# EAGLE design 4_cpu_control (EAGLE 6.6.0)

## Sheet 1 of 2
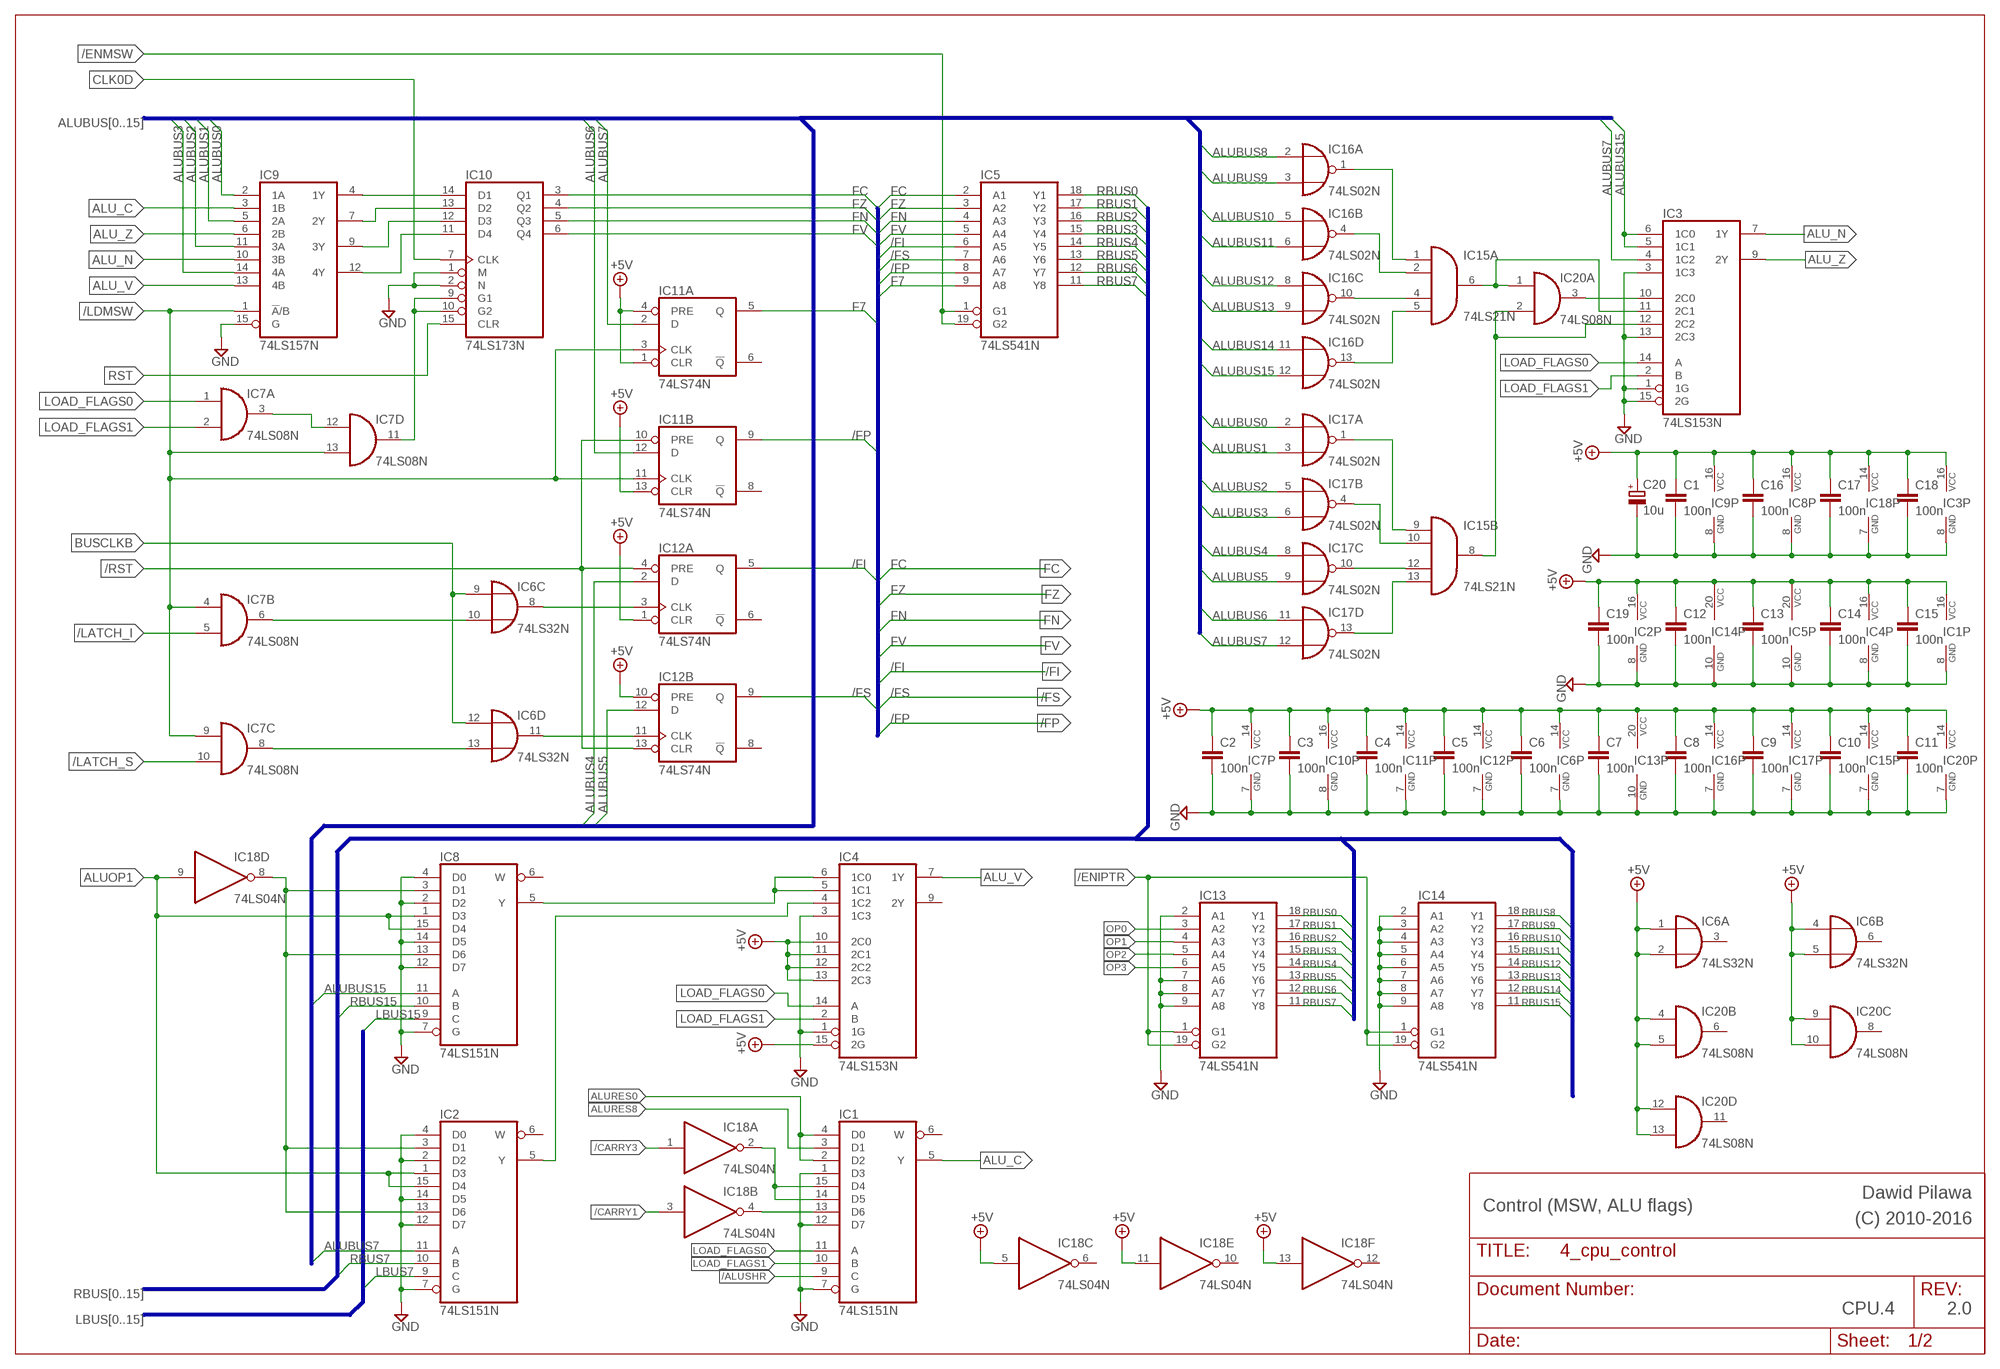
[diagram p0: schematic, sheet 1]

### Parts
C1  100n  C-EU050-024X044  [C050-024X044]
C2  100n  C-EU050-024X044  [C050-024X044]
C3  100n  C-EU050-024X044  [C050-024X044]
C4  100n  C-EU050-024X044  [C050-024X044]
C5  100n  C-EU050-024X044  [C050-024X044]
C6  100n  C-EU050-024X044  [C050-024X044]
C7  100n  C-EU050-024X044  [C050-024X044]
C8  100n  C-EU050-024X044  [C050-024X044]
C9  100n  C-EU050-024X044  [C050-024X044]
C10  100n  C-EU050-024X044  [C050-024X044]
C11  100n  C-EU050-024X044  [C050-024X044]
C12  100n  C-EU050-024X044  [C050-024X044]
C13  100n  C-EU050-024X044  [C050-024X044]
C14  100n  C-EU050-024X044  [C050-024X044]
C15  100n  C-EU050-024X044  [C050-024X044]
C16  100n  C-EU050-024X044  [C050-024X044]
C17  100n  C-EU050-024X044  [C050-024X044]
C18  100n  C-EU050-024X044  [C050-024X044]
C19  100n  C-EU050-024X044  [C050-024X044]
C20  10u  CPOL-EUE2.5-6  [E2,5-6]
IC1  74LS151N  [DIL16]
IC2  74LS151N  [DIL16]
IC3  74LS153N  [DIL16]
IC4  74LS153N  [DIL16]
IC5  74LS541N  [DIL20]
IC6  74LS32N  [DIL14]
IC7  74LS08N  [DIL14]
IC8  74LS151N  [DIL16]
IC9  74LS157N  [DIL16]
IC10  74LS173N  [DIL16]
IC11  74LS74N  [DIL14]
IC12  74LS74N  [DIL14]
IC13  74LS541N  [DIL20]
IC14  74LS541N  [DIL20]
IC15  74LS21N  [DIL14]
IC16  74LS02N  [DIL14]
IC17  74LS02N  [DIL14]
IC18  74LS04N  [DIL14]
IC20  74LS08N  [DIL14]

### Nets
+5V: C1.1 C2.1 C3.1 C4.1 C5.1 C6.1 C7.1 C8.1 C9.1 C10.1 C11.1 C12.1 C13.1 C14.1 C15.1 C16.1 C17.1 C18.1 C19.1 C20.+ IC1.16(VCC) IC2.16(VCC) IC3.16(VCC) IC4.10(2C0) IC4.11(2C1) IC4.12(2C2) IC4.13(2C3) IC4.15(2G) IC4.16(VCC) IC5.20(VCC) IC6.1(A:I0) IC6.2(A:I1) IC6.4(B:I0) IC6.5(B:I1) IC6.14(P:VCC) IC7.14(P:VCC) IC8.16(VCC) IC9.16(VCC) IC10.16(VCC) IC11.1(A:CLR) IC11.4(A:PRE) IC11.13(B:CLR) IC11.14(P:VCC) IC12.1(A:CLR) IC12.10(B:PRE) IC12.14(P:VCC) IC13.20(VCC) IC14.20(VCC) IC15.14(P:VCC) IC16.14(P:VCC) IC17.14(P:VCC) IC18.5(C:I) IC18.11(E:I) IC18.13(F:I) IC18.14(P:VCC) IC20.4(B:I0) IC20.5(B:I1) IC20.9(C:I0) IC20.10(C:I1) IC20.12(D:I0) IC20.13(D:I1) IC20.14(P:VCC) ; also sheet 2
/ALUSHR: IC1.9(C) ; also sheet 2
/CARRY1: IC18.3(B:I) ; also sheet 2
/CARRY3: IC18.1(A:I) ; also sheet 2
/ENIPTR: IC13.1(G1) IC13.19(G2) IC14.1(G1) IC14.19(G2) ; also sheet 2
/ENMSW: IC5.1(G1) IC5.19(G2) ; also sheet 2
/FI: IC5.6(A5) IC12.5(A:Q) ; also sheet 2
/FP: IC5.8(A7) IC11.9(B:Q) ; also sheet 2
/FS: IC5.7(A6) IC12.9(B:Q) ; also sheet 2
/LATCH_I: IC7.5(B:I1) ; also sheet 2
/LATCH_S: IC7.10(C:I1) ; also sheet 2
/LDMSW: IC7.4(B:I0) IC7.9(C:I0) IC7.13(D:I1) IC9.1(!A!/B) IC11.3(A:CLK) IC11.11(B:CLK) ; also sheet 2
/RST: IC11.10(B:PRE) IC12.4(A:PRE) IC12.13(B:CLR) ; also sheet 2
ALU_C: IC1.5(Y) IC9.3(1B)
ALU_N: IC3.7(1Y) IC9.10(3B)
ALU_V: IC4.7(1Y) IC9.13(4B)
ALU_Z: IC3.9(2Y) IC9.6(2B)
ALUBUS0: IC9.2(1A) IC17.2(A:I0) ; also sheet 2
ALUBUS1: IC9.5(2A) IC17.3(A:I1) ; also sheet 2
ALUBUS2: IC9.11(3A) IC17.5(B:I0) ; also sheet 2
ALUBUS3: IC9.14(4A) IC17.6(B:I1) ; also sheet 2
ALUBUS4: IC12.2(A:D) IC17.8(C:I0) ; also sheet 2
ALUBUS5: IC12.12(B:D) IC17.9(C:I1) ; also sheet 2
ALUBUS6: IC11.12(B:D) IC17.11(D:I0) ; also sheet 2
ALUBUS7: IC2.11(A) IC3.4(1C2) IC11.2(A:D) IC17.12(D:I1) ; also sheet 2
ALUBUS8: IC16.2(A:I0) ; also sheet 2
ALUBUS9: IC16.3(A:I1) ; also sheet 2
ALUBUS10: IC16.5(B:I0) ; also sheet 2
ALUBUS11: IC16.6(B:I1) ; also sheet 2
ALUBUS12: IC16.8(C:I0) ; also sheet 2
ALUBUS13: IC16.9(C:I1) ; also sheet 2
ALUBUS14: IC16.11(D:I0) ; also sheet 2
ALUBUS15: IC3.5(1C1) IC3.6(1C0) IC8.11(A) IC16.12(D:I1) ; also sheet 2
ALUOP1: IC2.1(D3) IC2.15(D4) IC8.1(D3) IC8.15(D4) IC18.9(D:I) ; also sheet 2
ALURES0: IC1.2(D2) IC1.4(D0) ; also sheet 2
ALURES8: IC1.3(D1) ; also sheet 2
BUSCLKB: IC6.9(C:I0) IC6.12(D:I0) ; also sheet 2
CLK0D: IC10.7(CLK) ; also sheet 2
F7: IC5.9(A8) IC11.5(A:Q)
FC: IC5.2(A1) IC10.3(Q1) ; also sheet 2
FN: IC5.4(A3) IC10.5(Q3) ; also sheet 2
FV: IC5.5(A4) IC10.6(Q4) ; also sheet 2
FZ: IC5.3(A2) IC10.4(Q2) ; also sheet 2
GND: C1.2 C2.2 C3.2 C4.2 C5.2 C6.2 C7.2 C8.2 C9.2 C10.2 C11.2 C12.2 C13.2 C14.2 C15.2 C16.2 C17.2 C18.2 C19.2 C20.- IC1.1(D3) IC1.7(G) IC1.8(GND) IC1.12(D7) IC2.2(D2) IC2.4(D0) IC2.7(G) IC2.8(GND) IC2.12(D7) IC2.14(D5) IC3.1(1G) IC3.3(1C3) IC3.8(GND) IC3.13(2C3) IC3.15(2G) IC4.1(1G) IC4.3(1C3) IC4.8(GND) IC5.10(GND) IC6.7(P:GND) IC7.7(P:GND) IC8.2(D2) IC8.4(D0) IC8.7(G) IC8.8(GND) IC8.12(D7) IC8.14(D5) IC9.8(GND) IC9.15(G) IC10.1(M) IC10.2(N) IC10.8(GND) IC11.7(P:GND) IC12.7(P:GND) IC13.2(A1) IC13.7(A6) IC13.8(A7) IC13.9(A8) IC13.10(GND) IC14.2(A1) IC14.3(A2) IC14.4(A3) IC14.5(A4) IC14.6(A5) IC14.7(A6) IC14.8(A7) IC14.9(A8) IC14.10(GND) IC15.7(P:GND) IC16.7(P:GND) IC17.7(P:GND) IC18.7(P:GND) IC20.7(P:GND) ; also sheet 2
LBUS7: IC2.9(C) ; also sheet 2
LBUS15: IC8.9(C) ; also sheet 2
LOAD_FLAGS0: IC1.11(A) IC3.14(A) IC4.14(A) IC7.1(A:I0) ; also sheet 2
LOAD_FLAGS1: IC1.10(B) IC3.2(B) IC4.2(B) IC7.2(A:I1) ; also sheet 2
N$1: IC4.5(1C1) IC4.6(1C0) IC8.5(Y)
N$2: IC1.13(D6) IC18.4(B:O)
N$3: IC1.14(D5) IC1.15(D4) IC18.2(A:O)
N$6: IC15.1(A:I0) IC16.1(A:O)
N$7: IC15.2(A:I1) IC16.4(B:O)
N$8: IC15.4(A:I2) IC16.10(C:O)
N$9: IC15.5(A:I3) IC16.13(D:O)
N$10: IC15.9(B:I0) IC17.1(A:O)
N$11: IC15.10(B:I1) IC17.4(B:O)
N$12: IC15.12(B:I2) IC17.10(C:O)
N$13: IC15.13(B:I3) IC17.13(D:O)
N$14: IC3.11(2C1) IC15.6(A:O) IC20.1(A:I0)
N$15: IC3.12(2C2) IC15.8(B:O) IC20.2(A:I1)
N$16: IC3.10(2C0) IC20.3(A:O)
N$17: IC7.11(D:O) IC10.9(G1) IC10.10(G2)
N$19: IC2.5(Y) IC4.4(1C2)
N$21: IC2.3(D1) IC2.13(D6) IC8.3(D1) IC8.13(D6) IC18.8(D:O)
N$32: IC9.4(1Y) IC10.14(D1)
N$48: IC9.7(2Y) IC10.13(D2)
N$49: IC9.9(3Y) IC10.12(D3)
N$50: IC9.12(4Y) IC10.11(D4)
N$51: IC7.3(A:O) IC7.12(D:I0)
N$52: IC6.8(C:O) IC12.3(A:CLK)
N$53: IC6.11(D:O) IC12.11(B:CLK)
N$54: IC6.10(C:I1) IC7.6(B:O)
N$55: IC6.13(D:I1) IC7.8(C:O)
OP0: IC13.3(A2) ; also sheet 2
OP1: IC13.4(A3) ; also sheet 2
OP2: IC13.5(A4) ; also sheet 2
OP3: IC13.6(A5) ; also sheet 2
RBUS0: IC5.18(Y1) IC13.18(Y1) ; also sheet 2
RBUS1: IC5.17(Y2) IC13.17(Y2) ; also sheet 2
RBUS2: IC5.16(Y3) IC13.16(Y3) ; also sheet 2
RBUS3: IC5.15(Y4) IC13.15(Y4) ; also sheet 2
RBUS4: IC5.14(Y5) IC13.14(Y5) ; also sheet 2
RBUS5: IC5.13(Y6) IC13.13(Y6) ; also sheet 2
RBUS6: IC5.12(Y7) IC13.12(Y7) ; also sheet 2
RBUS7: IC2.10(B) IC5.11(Y8) IC13.11(Y8) ; also sheet 2
RBUS8: IC14.18(Y1) ; also sheet 2
RBUS9: IC14.17(Y2) ; also sheet 2
RBUS10: IC14.16(Y3) ; also sheet 2
RBUS11: IC14.15(Y4) ; also sheet 2
RBUS12: IC14.14(Y5) ; also sheet 2
RBUS13: IC14.13(Y6) ; also sheet 2
RBUS14: IC14.12(Y7) ; also sheet 2
RBUS15: IC8.10(B) IC14.11(Y8) ; also sheet 2
RST: IC10.15(CLR) ; also sheet 2
Unconnected: IC1.6(W) IC2.6(W) IC4.9(2Y) IC6.3(A:O) IC6.6(B:O) IC8.6(W) IC11.6(A:!Q) IC11.8(B:!Q) IC12.6(A:!Q) IC12.8(B:!Q) IC18.6(C:O) IC18.10(E:O) IC18.12(F:O) IC20.6(B:O) IC20.8(C:O) IC20.11(D:O)

### Buses
ALUBUS[0..15]
FC,FZ,FN,FV,/FI,/FS,/FP,F7
RBUS[0..15]
LBUS[0..15]

### Notes on the sheet
- Dawid Pilawa
- Control (MSW, ALU flags) | (C) 2010-2016
- CPU.4 | 2.0

## Sheet 2 of 2
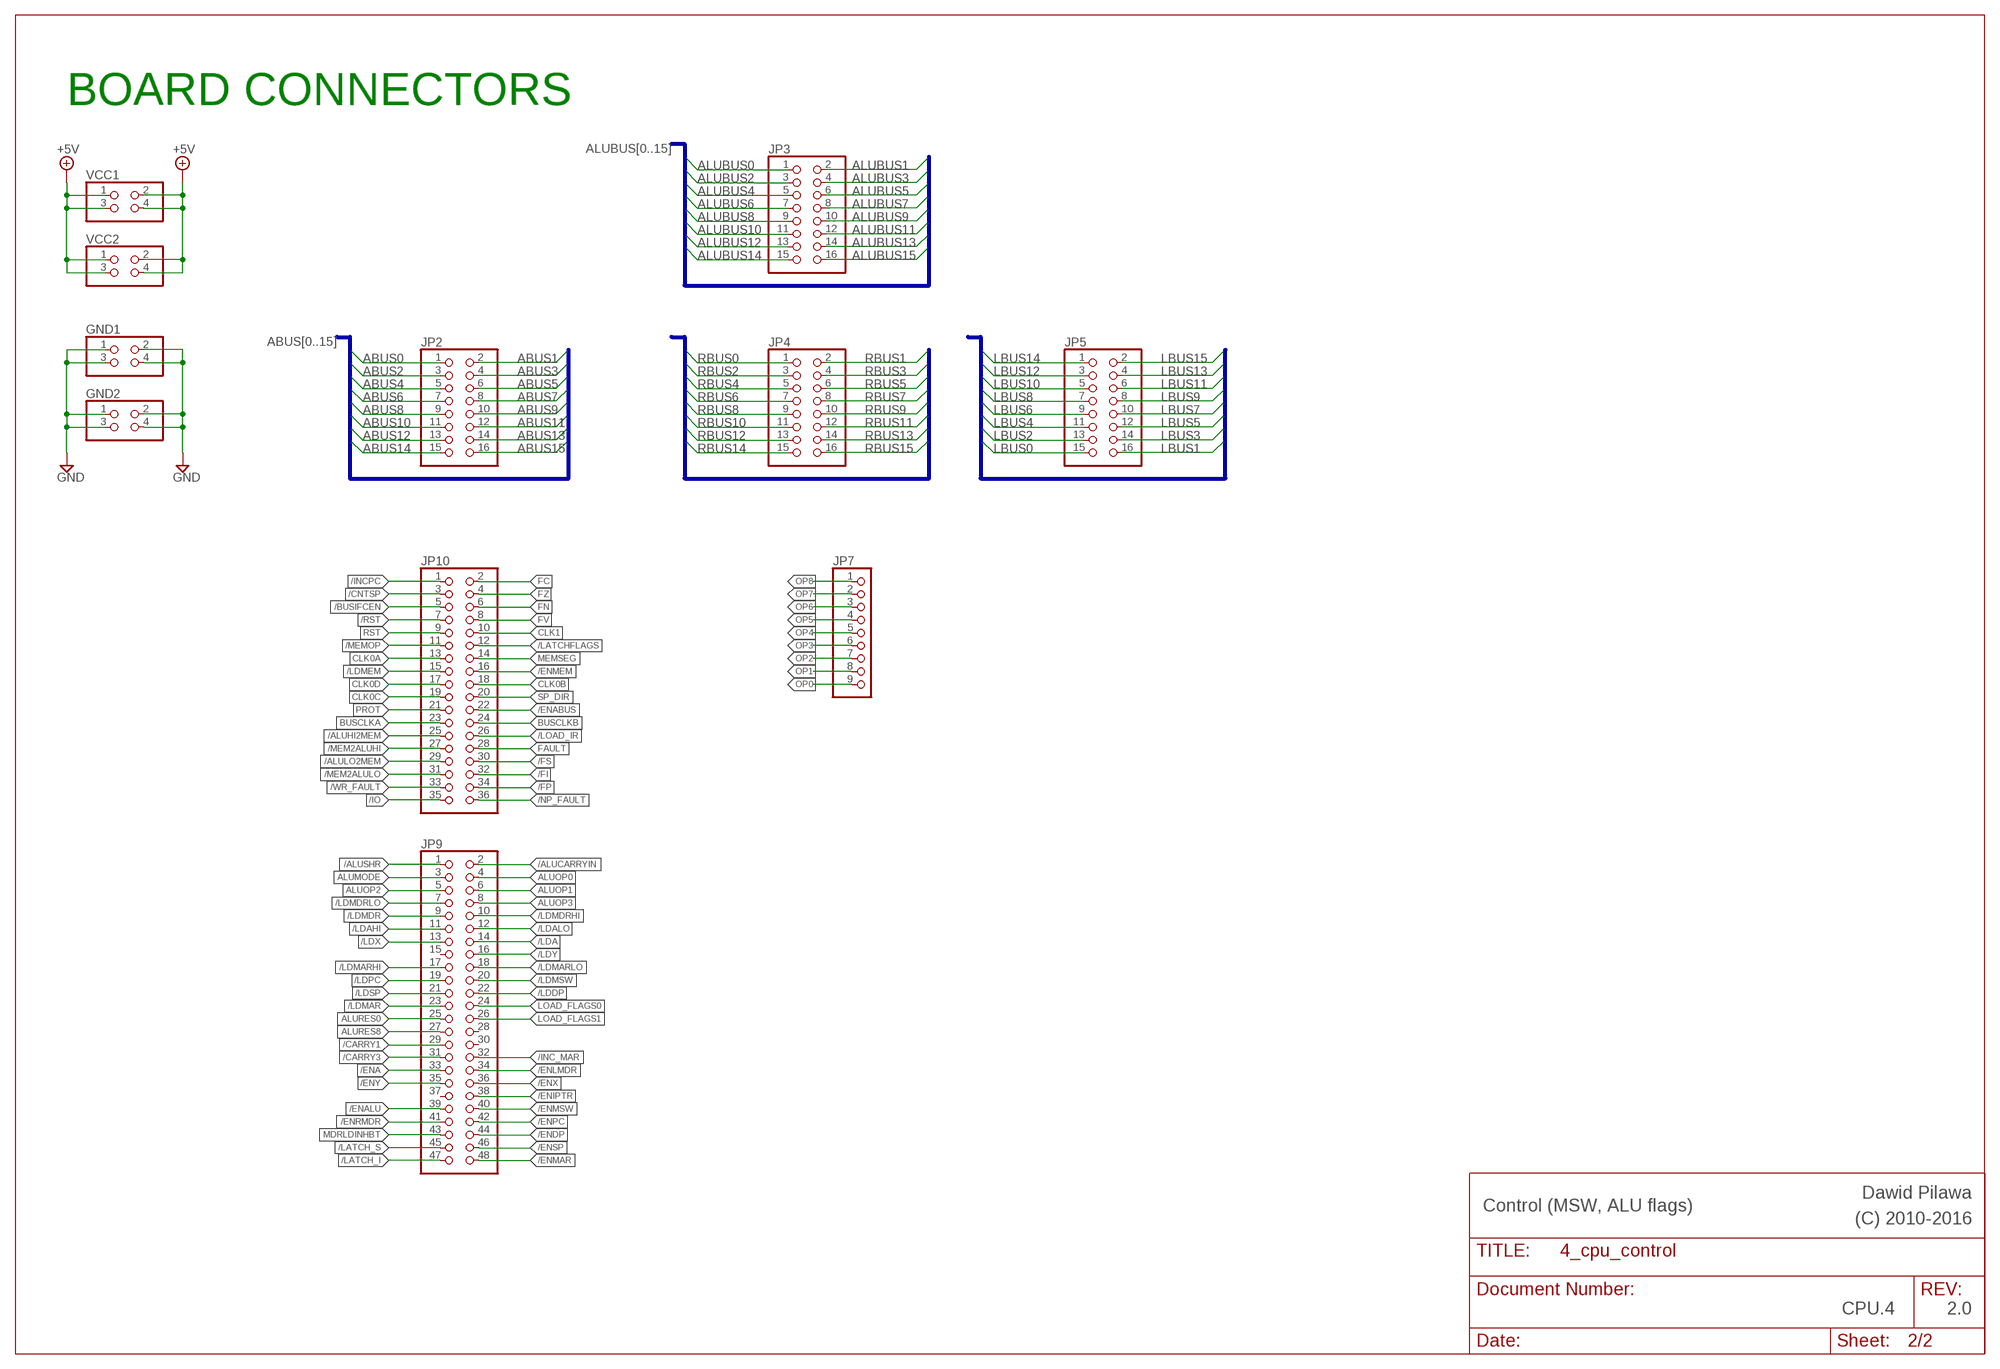
[diagram p1: schematic, sheet 2]

### Parts
GND1  PINHD-2X2  [2X02]
GND2  PINHD-2X2  [2X02]
JP2  PINHD-2X8  [2X08]
JP3  PINHD-2X8  [2X08]
JP4  PINHD-2X8  [2X08]
JP5  PINHD-2X8  [2X08]
JP7  PINHD-1X9  [1X09]
JP9  PINHD-2X24  [2X24]
JP10  PINHD-2X18  [2X18]
VCC1  PINHD-2X2  [2X02]
VCC2  PINHD-2X2  [2X02]

### Nets
+5V: VCC1.1 VCC1.2 VCC1.3 VCC1.4 VCC2.1 VCC2.2 VCC2.3 VCC2.4 ; also sheet 1
/ALUCARRYIN: JP9.2
/ALUHI2MEM: JP10.25
/ALULO2MEM: JP10.29
/ALUSHR: JP9.1 ; also sheet 1
/BUSIFCEN: JP10.5
/CARRY1: JP9.29 ; also sheet 1
/CARRY3: JP9.31 ; also sheet 1
/CNTSP: JP10.3
/ENA: JP9.33
/ENABUS: JP10.22
/ENALU: JP9.39
/ENDP: JP9.44
/ENIPTR: JP9.38 ; also sheet 1
/ENLMDR: JP9.34
/ENMAR: JP9.48
/ENMEM: JP10.16
/ENMSW: JP9.40 ; also sheet 1
/ENPC: JP9.42
/ENRMDR: JP9.41
/ENSP: JP9.46
/ENX: JP9.36
/ENY: JP9.35
/FI: JP10.32 ; also sheet 1
/FP: JP10.34 ; also sheet 1
/FS: JP10.30 ; also sheet 1
/INC_MAR: JP9.32
/INCPC: JP10.1
/IO: JP10.35
/LATCH_I: JP9.47 ; also sheet 1
/LATCH_S: JP9.45 ; also sheet 1
/LATCHFLAGS: JP10.12
/LDA: JP9.14
/LDAHI: JP9.11
/LDALO: JP9.12
/LDDP: JP9.22
/LDMAR: JP9.23
/LDMARHI: JP9.17
/LDMARLO: JP9.18
/LDMDR: JP9.9
/LDMDRHI: JP9.10
/LDMDRLO: JP9.7
/LDMEM: JP10.15
/LDMSW: JP9.20 ; also sheet 1
/LDPC: JP9.19
/LDSP: JP9.21
/LDX: JP9.13
/LDY: JP9.16
/LOAD_IR: JP10.26
/MEM2ALUHI: JP10.27
/MEM2ALULO: JP10.31
/MEMOP: JP10.11
/NP_FAULT: JP10.36
/RST: JP10.7 ; also sheet 1
/WR_FAULT: JP10.33
ABUS0: JP2.1
ABUS1: JP2.2
ABUS2: JP2.3
ABUS3: JP2.4
ABUS4: JP2.5
ABUS5: JP2.6
ABUS6: JP2.7
ABUS7: JP2.8
ABUS8: JP2.9
ABUS9: JP2.10
ABUS10: JP2.11
ABUS11: JP2.12
ABUS12: JP2.13
ABUS13: JP2.14
ABUS14: JP2.15
ABUS15: JP2.16
ALUBUS0: JP3.1 ; also sheet 1
ALUBUS1: JP3.2 ; also sheet 1
ALUBUS2: JP3.3 ; also sheet 1
ALUBUS3: JP3.4 ; also sheet 1
ALUBUS4: JP3.5 ; also sheet 1
ALUBUS5: JP3.6 ; also sheet 1
ALUBUS6: JP3.7 ; also sheet 1
ALUBUS7: JP3.8 ; also sheet 1
ALUBUS8: JP3.9 ; also sheet 1
ALUBUS9: JP3.10 ; also sheet 1
ALUBUS10: JP3.11 ; also sheet 1
ALUBUS11: JP3.12 ; also sheet 1
ALUBUS12: JP3.13 ; also sheet 1
ALUBUS13: JP3.14 ; also sheet 1
ALUBUS14: JP3.15 ; also sheet 1
ALUBUS15: JP3.16 ; also sheet 1
ALUMODE: JP9.3
ALUOP0: JP9.4
ALUOP1: JP9.6 ; also sheet 1
ALUOP2: JP9.5
ALUOP3: JP9.8
ALURES0: JP9.25 ; also sheet 1
ALURES8: JP9.27 ; also sheet 1
BUSCLKA: JP10.23
BUSCLKB: JP10.24 ; also sheet 1
CLK0A: JP10.13
CLK0B: JP10.18
CLK0C: JP10.19
CLK0D: JP10.17 ; also sheet 1
CLK1: JP10.10
FAULT: JP10.28
FC: JP10.2 ; also sheet 1
FN: JP10.6 ; also sheet 1
FV: JP10.8 ; also sheet 1
FZ: JP10.4 ; also sheet 1
GND: GND1.1 GND1.2 GND1.3 GND1.4 GND2.1 GND2.2 GND2.3 GND2.4 ; also sheet 1
LBUS0: JP5.15
LBUS1: JP5.16
LBUS2: JP5.13
LBUS3: JP5.14
LBUS4: JP5.11
LBUS5: JP5.12
LBUS6: JP5.9
LBUS7: JP5.10 ; also sheet 1
LBUS8: JP5.7
LBUS9: JP5.8
LBUS10: JP5.5
LBUS11: JP5.6
LBUS12: JP5.3
LBUS13: JP5.4
LBUS14: JP5.1
LBUS15: JP5.2 ; also sheet 1
LOAD_FLAGS0: JP9.24 ; also sheet 1
LOAD_FLAGS1: JP9.26 ; also sheet 1
MDRLDINHBT: JP9.43
MEMSEG: JP10.14
OP0: JP7.9 ; also sheet 1
OP1: JP7.8 ; also sheet 1
OP2: JP7.7 ; also sheet 1
OP3: JP7.6 ; also sheet 1
OP4: JP7.5
OP5: JP7.4
OP6: JP7.3
OP7: JP7.2
OP8: JP7.1
PROT: JP10.21
RBUS0: JP4.1 ; also sheet 1
RBUS1: JP4.2 ; also sheet 1
RBUS2: JP4.3 ; also sheet 1
RBUS3: JP4.4 ; also sheet 1
RBUS4: JP4.5 ; also sheet 1
RBUS5: JP4.6 ; also sheet 1
RBUS6: JP4.7 ; also sheet 1
RBUS7: JP4.8 ; also sheet 1
RBUS8: JP4.9 ; also sheet 1
RBUS9: JP4.10 ; also sheet 1
RBUS10: JP4.11 ; also sheet 1
RBUS11: JP4.12 ; also sheet 1
RBUS12: JP4.13 ; also sheet 1
RBUS13: JP4.14 ; also sheet 1
RBUS14: JP4.15 ; also sheet 1
RBUS15: JP4.16 ; also sheet 1
RST: JP10.9 ; also sheet 1
SP_DIR: JP10.20
Unconnected: JP9.15 JP9.28 JP9.30 JP9.37

### Buses
ALUBUS[0..15]
RBUS[0..15]
LBUS[0..15]
ABUS[0..15]

### Notes on the sheet
- BOARD CONNECTORS
- Dawid Pilawa
- Control (MSW, ALU flags) | (C) 2010-2016
- CPU.4 | 2.0

## Library data of the parts
C1-C19 = rcl:C-EU: CAPACITOR, European symbol
C20 = rcl:CPOL-EU: POLARIZED CAPACITOR, European symbol
GND1 GND2 VCC1 VCC2 = pinhead:PINHD-2X2: PIN HEADER
IC1 IC2 IC8 = 74xx-eu:74*151: Data SELECTOR/MULTIPLEXER
IC3 IC4 = 74xx-eu:74*153: Dual 4-line to 1-line data SELECTOR/MULTIPLEXER
IC5 IC13 IC14 = 74xx-us:74*541: Octal BUFFER and LINE DRIVER, 3-state
IC6 = 74xx-eu:74*32: Quad 2-input OR gate
IC7 IC20 = 74xx-eu:74*08: Quad 2-input AND gate
IC9 = 74xx-eu:74*157: Quadruple 2-line to 1-line data SELECTOR/MULTIPLEXER
IC10 = 74xx-eu:74*173: 4-bit D type REGISTER, 3-state
IC11 IC12 = 74xx-eu:74*74: Dual D type positive edge triggered FLIP FLOP, preset and clear
IC15 = 74xx-eu:74*21: Dual 4-input AND gate
IC16 IC17 = 74xx-eu:74*02: Quad 2-input NOR gate
IC18 = 74xx-eu:74*04: Hex INVERTER
JP2-JP5 = pinhead:PINHD-2X8: PIN HEADER
JP7 = pinhead:PINHD-1X9: PIN HEADER
JP9 = pinhead:PINHD-2X24: PIN HEADER
JP10 = pinhead:PINHD-2X18: PIN HEADER

## Board
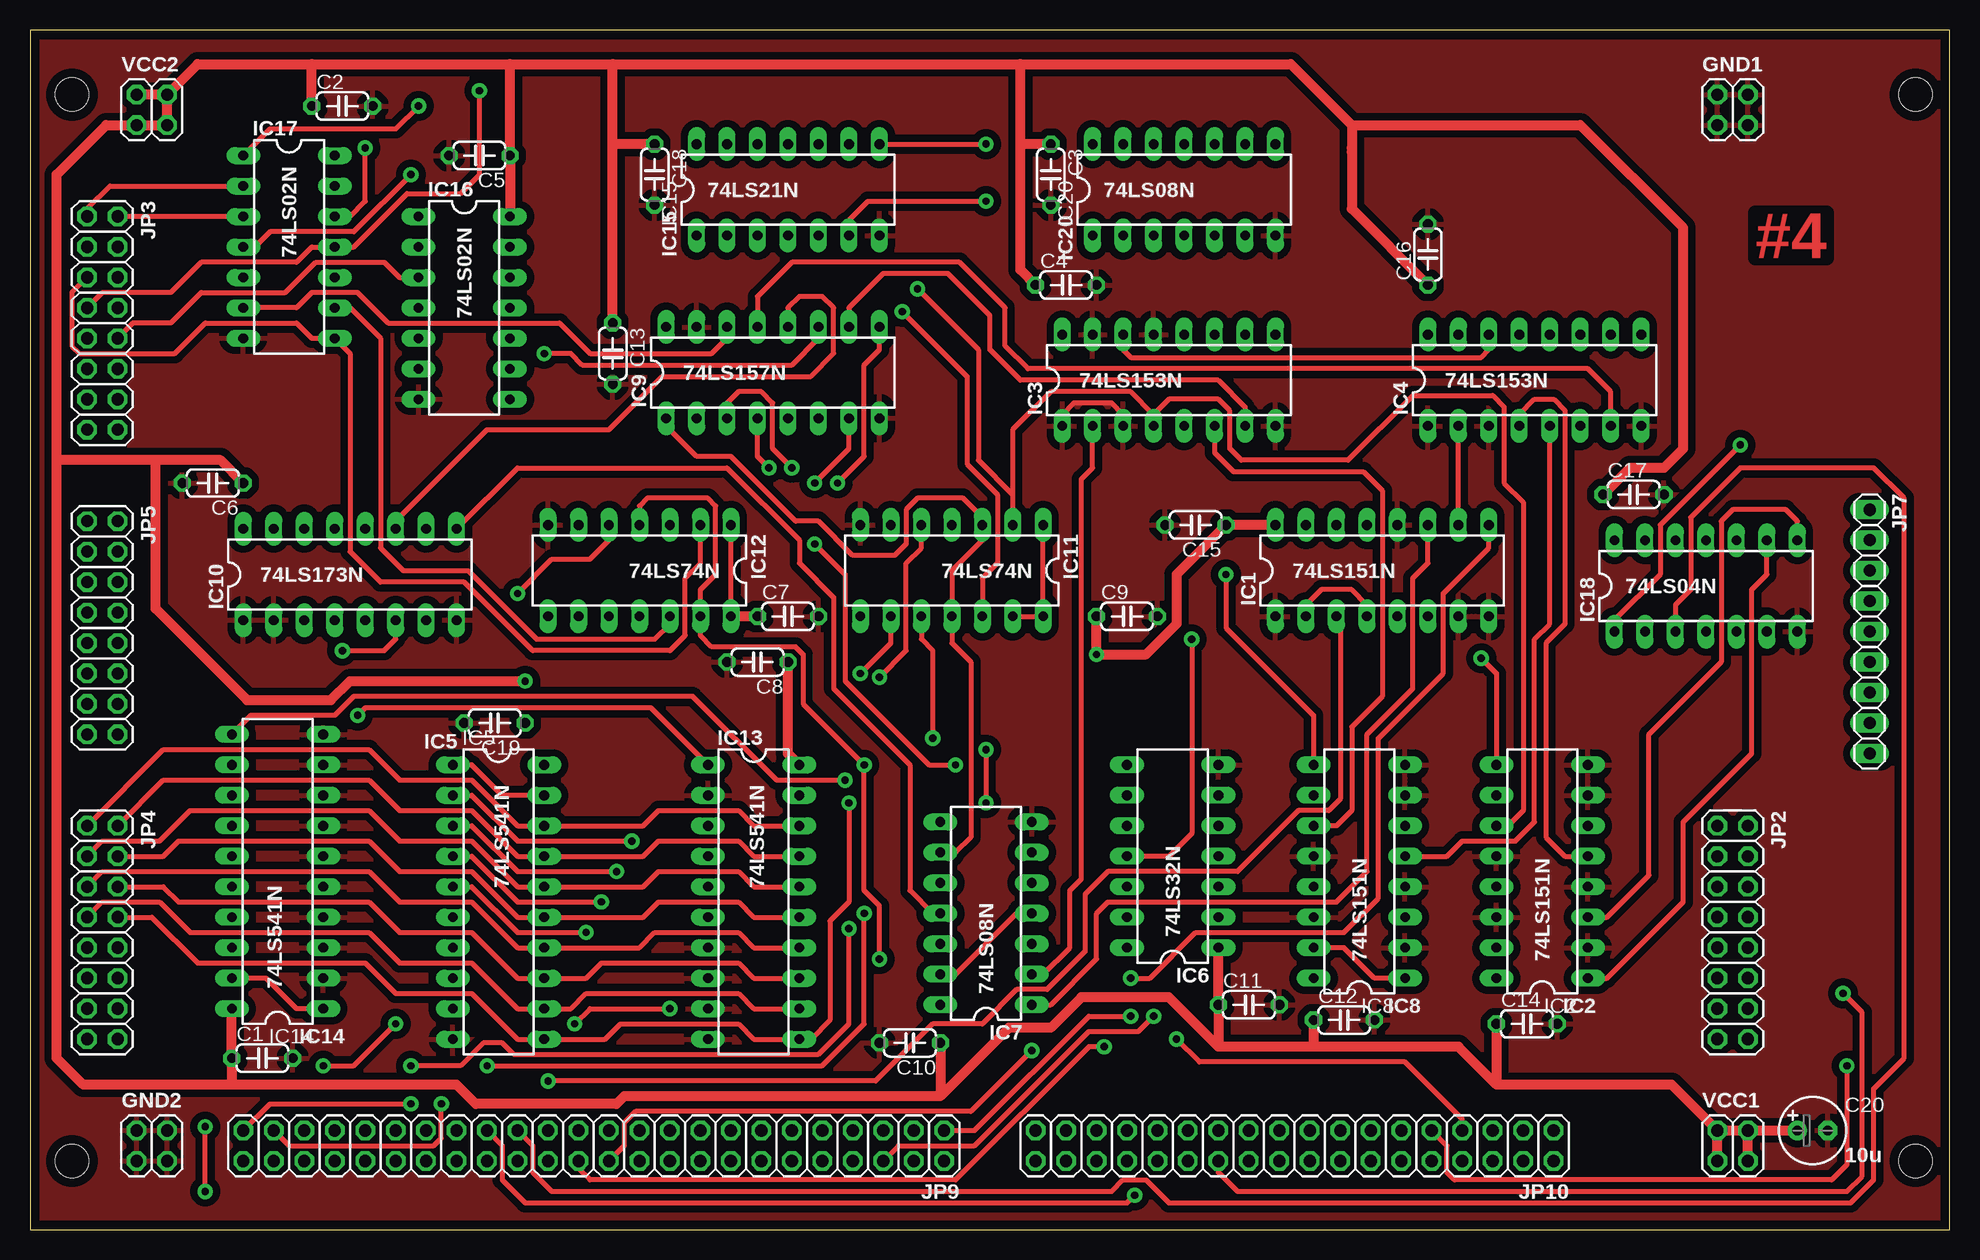
[diagram p2: board, top side]
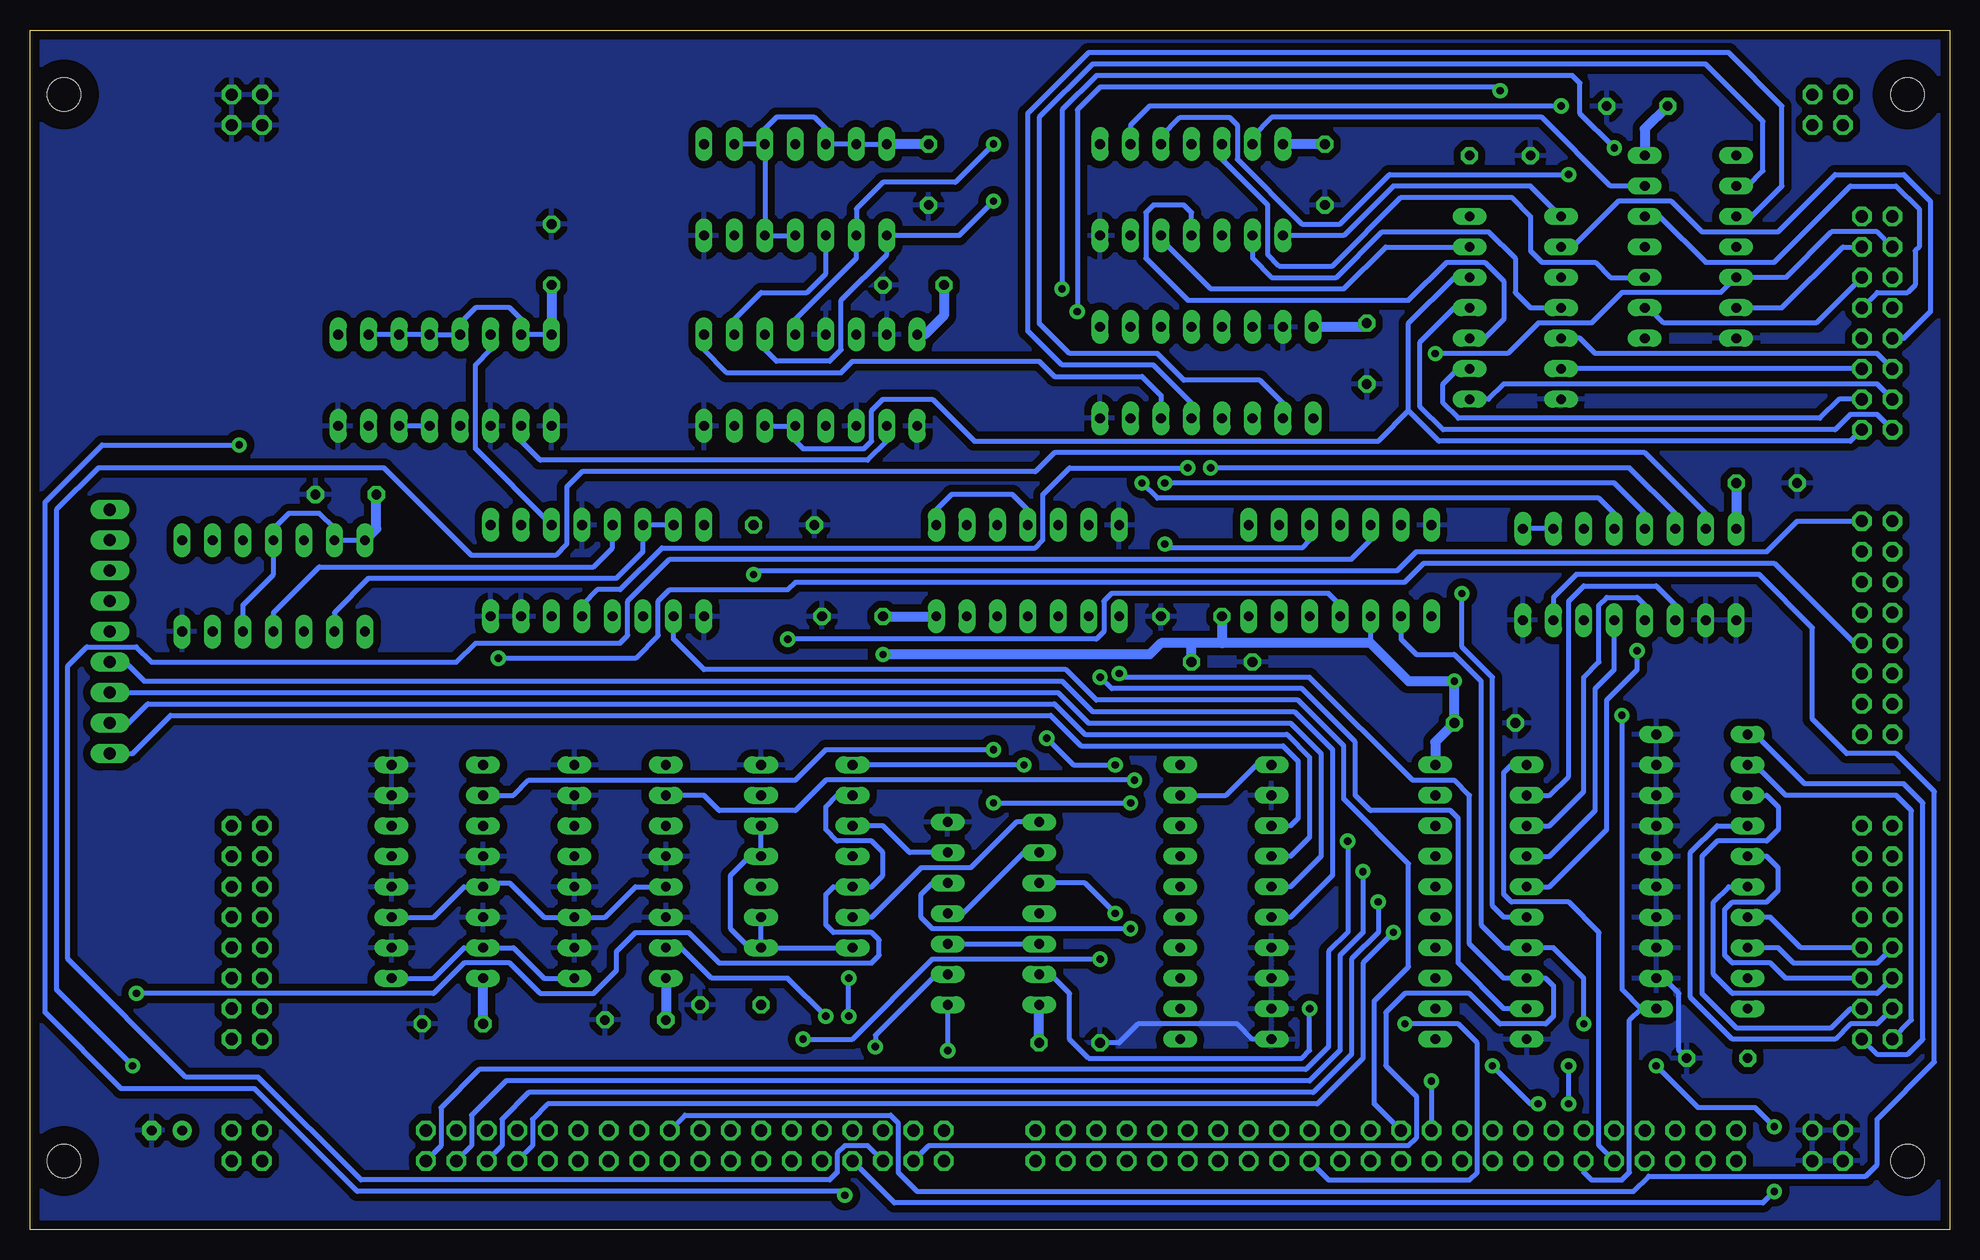
[diagram p3: board, bottom side, seen from below]

Size 160 x 100 mm. Coordinates in mm from the lower left corner, seen from the top.
Outline: 0,0 160,0 160,100 0,100 0,0
Copper layers (1*16): Top 0.035mm / dielectric 1.5mm / Bottom 0.035mm
Design rules "homebrew_pcb": minimum track width 16mil, minimum drill 24mil, track to track 16mil, track to pad 10mil, pad to pad 10mil, via to via 10mil, smd to smd 8mil, copper to edge 30mil, drill to drill 10mil, minimum pad ring 12mil, minimum via ring 12mil, stop-mask expansion 4mil, vias tented up to drill 0mil, thermal gap 24mil
Holes 2.79 mm at 3.49,94.61 3.49,5.71 157.16,5.71 157.16,94.61
bRestrict: area 1.2,92.3 to 5.8,96.9; area 1.2,3.4 to 5.8,8; area 154.9,3.4 to 159.4,8; area 154.9,92.3 to 159.4,96.9
vRestrict: area 1.2,92.3 to 5.8,96.9; area 154.9,3.4 to 159.4,8; area 154.9,92.3 to 159.4,96.9; area 1.2,3.4 to 5.8,8

### Footprints (pad centres in the part's own frame; a part is rotated, then mirrored left to right if it is on the bottom)
C050-024X044 = drill 0.813 octagon: 1 -2.54,0; 2 2.54,0
E2,5-6 = drill 0.813 pad 1.6: + -1.27,0 | drill 0.813 pad 1.6 octagon: - 1.27,0
2X02 = drill 1.016 octagon: 1 -1.27,-1.27; 2 -1.27,1.27; 3 1.27,-1.27; 4 1.27,1.27
DIL16 = drill 0.813 long: 1 -8.89,-3.81; 2 -6.35,-3.81; 3 -3.81,-3.81; 4 -1.27,-3.81; 5 1.27,-3.81; 6 3.81,-3.81; 7 6.35,-3.81; 8 8.89,-3.81; 9 8.89,3.81; 10 6.35,3.81; 11 3.81,3.81; 12 1.27,3.81; 13 -1.27,3.81; 14 -3.81,3.81; 15 -6.35,3.81; 16 -8.89,3.81
DIL20 = drill 0.813 long: 1 -11.43,-3.81; 2 -8.89,-3.81; 3 -6.35,-3.81; 4 -3.81,-3.81; 5 -1.27,-3.81; 6 1.27,-3.81; 7 3.81,-3.81; 8 6.35,-3.81; 9 8.89,-3.81; 10 11.43,-3.81; 11 11.43,3.81; 12 8.89,3.81; 13 6.35,3.81; 14 3.81,3.81; 15 1.27,3.81; 16 -1.27,3.81; 17 -3.81,3.81; 18 -6.35,3.81; 19 -8.89,3.81; 20 -11.43,3.81
DIL14 = drill 0.813 long: 1 -7.62,-3.81; 2 -5.08,-3.81; 3 -2.54,-3.81; 4 0,-3.81; 5 2.54,-3.81; 6 5.08,-3.81; 7 7.62,-3.81; 8 7.62,3.81; 9 5.08,3.81; 10 2.54,3.81; 11 0,3.81; 12 -2.54,3.81; 13 -5.08,3.81; 14 -7.62,3.81
2X08 = drill 1.016 octagon: 1 -8.89,-1.27; 2 -8.89,1.27; 3 -6.35,-1.27; 4 -6.35,1.27; 5 -3.81,-1.27; 6 -3.81,1.27; 7 -1.27,-1.27; 8 -1.27,1.27; 9 1.27,-1.27; 10 1.27,1.27; 11 3.81,-1.27; 12 3.81,1.27; 13 6.35,-1.27; 14 6.35,1.27; 15 8.89,-1.27; 16 8.89,1.27
1X09 = drill 1.016 long: 1 -10.16,0; 2 -7.62,0; 3 -5.08,0; 4 -2.54,0; 5 0,0; 6 2.54,0; 7 5.08,0; 8 7.62,0; 9 10.16,0
2X24 = drill 1.016 octagon: 1 -27.94,-1.27; 2 -27.94,1.27; 3 -25.4,-1.27; 4 -25.4,1.27; 5 -22.86,-1.27; 6 -22.86,1.27; 7 -20.32,-1.27; 8 -20.32,1.27; 9 -17.78,-1.27; 10 -17.78,1.27; 11 -15.24,-1.27; 12 -15.24,1.27; 13 -12.7,-1.27; 14 -12.7,1.27; 15 -10.16,-1.27; 16 -10.16,1.27; 17 -7.62,-1.27; 18 -7.62,1.27; 19 -5.08,-1.27; 20 -5.08,1.27; 21 -2.54,-1.27; 22 -2.54,1.27; 23 0,-1.27; 24 0,1.27; 25 2.54,-1.27; 26 2.54,1.27; 27 5.08,-1.27; 28 5.08,1.27; 29 7.62,-1.27; 30 7.62,1.27; 31 10.16,-1.27; 32 10.16,1.27; 33 12.7,-1.27; 34 12.7,1.27; 35 15.24,-1.27; 36 15.24,1.27; 37 17.78,-1.27; 38 17.78,1.27; 39 20.32,-1.27; 40 20.32,1.27; 41 22.86,-1.27; 42 22.86,1.27; 43 25.4,-1.27; 44 25.4,1.27; 45 27.94,-1.27; 46 27.94,1.27; 47 30.48,-1.27; 48 30.48,1.27
2X18 = drill 1.016 octagon: 1 -21.59,-1.27; 2 -21.59,1.27; 3 -19.05,-1.27; 4 -19.05,1.27; 5 -16.51,-1.27; 6 -16.51,1.27; 7 -13.97,-1.27; 8 -13.97,1.27; 9 -11.43,-1.27; 10 -11.43,1.27; 11 -8.89,-1.27; 12 -8.89,1.27; 13 -6.35,-1.27; 14 -6.35,1.27; 15 -3.81,-1.27; 16 -3.81,1.27; 17 -1.27,-1.27; 18 -1.27,1.27; 19 1.27,-1.27; 20 1.27,1.27; 21 3.81,-1.27; 22 3.81,1.27; 23 6.35,-1.27; 24 6.35,1.27; 25 8.89,-1.27; 26 8.89,1.27; 27 11.43,-1.27; 28 11.43,1.27; 29 13.97,-1.27; 30 13.97,1.27; 31 16.51,-1.27; 32 16.51,1.27; 33 19.05,-1.27; 34 19.05,1.27; 35 21.59,-1.27; 36 21.59,1.27

### Placement (x,y rotation side)
C1  19.37,14.29 0 top
C2  26.04,93.66 0 top
C3  85.09,87.95 270 top
C4  86.36,78.74 0 top
C5  37.47,89.53 180 top
C6  15.24,62.23 180 top
C7  63.18,51.12 0 top
C8  60.64,47.31 180 top
C9  91.44,51.12 0 top
C10  73.34,15.56 180 top
C11  101.6,18.73 0 top
C12  109.54,17.46 0 top
C13  48.58,73.03 270 top
C14  124.78,17.14 0 top
C15  97.16,58.74 180 top
C16  116.52,81.28 90 top
C17  133.67,61.28 0 top
C18  52.07,87.95 270 top
C19  38.73,42.23 180 top
C20  148.59,8.26 0 top
GND1  141.92,93.34 0 top
GND2  10.16,6.99 0 top
IC1  112.71,54.93 0 top
IC2  126.05,29.84 90 top
IC3  94.93,70.8 0 top
IC4  125.41,70.8 0 top
IC5  39.05,27.3 270 top
IC6  95.25,31.11 90 top
IC7  79.69,26.35 90 top
IC8  110.81,29.84 90 top
IC9  61.91,71.44 0 top
IC10  26.67,54.61 0 top
IC11  76.83,54.93 180 top
IC12  50.8,54.93 180 top
IC13  60.33,27.3 270 top
IC14  20.64,29.84 90 top
IC15  63.18,86.68 0 top
IC16  36.2,76.83 270 top
IC17  21.59,81.92 270 top
IC18  139.7,53.66 0 top
IC20  96.2,86.68 0 top
JP2  141.92,24.77 270 top
JP3  6.03,75.56 270 top
JP4  6.03,24.77 270 top
JP5  6.03,50.16 270 top
JP7  153.35,49.85 270 top
JP9  48.26,6.99 180 top
JP10  105.41,6.99 180 top
VCC1  141.92,6.99 0 top
VCC2  10.16,93.34 0 top

### Tracks (layer width: path | path; a pad name or v marks a point on that pad's centre or on a via)
+5V  (via drill 0.61 pad 1.27)
  Top 0.406: IC12.14 IC12.1 | IC11.1 IC11.14 IC11.13
  Top 0.813: VCC1.2 136.84,12.06 122.24,12.06 | 75.88,11.11 49.53,11.11 48.9,10.48 37.15,10.48 35.56,12.06 16.83,12.06 | 16.83,12.06 4.45,12.06 2.22,14.29 2.22,64.14 | 2.22,64.14 2.22,87.95 6.35,92.08 VCC2.1 VCC2.3 VCC2.4 | VCC2.4 13.97,97.16 23.5,97.16 | 23.5,97.16 40.01,97.16 | 40.01,97.16 48.58,97.16 | 48.58,97.16 82.55,97.16 | 82.55,97.16 105.09,97.16 110.17,92.08 | C13.1 48.58,90.49 | 48.58,90.49 48.58,97.16 | C18.1 48.58,90.49 | C2.1 23.5,97.16 | 40.01,97.16 C5.1 IC16.14 | 82.55,90.49 82.55,97.16 | C3.1 82.55,90.49 | C7.1 IC12.14 | IC1.16 C15.1 95.57,54.61 95.57,50.48 93.03,47.94 v88.9,47.94 C9.1 | VCC2.4 VCC2.2 | VCC1.1 VCC1.2 | VCC1.3 VCC1.4 | VCC1.2 VCC1.4 | VCC1.4 C20.+ | C10.1 75.88,11.11 | IC6.1 C11.1 99.06,15.24 | C14.1 122.24,12.06 | 82.55,90.49 82.55,80.01 C4.1 | C6.1 15.88,64.14 10.48,64.14 | 10.48,64.14 2.22,64.14 | 10.48,64.14 10.48,51.75 18.1,44.13 25.08,44.13 26.67,45.72 v41.27,45.72 | IC13.20 63.18,39.69 C8.1 | 122.24,12.06 119.06,15.24 107,15.24 | 107,15.24 99.06,15.24 | 99.06,15.24 94.93,19.37 87.63,19.37 85.09,16.83 81.6,16.83 75.88,11.11 | C12.1 107,15.24 | IC14.20 C1.1 16.83,12.06 | C17.1 133.35,63.5 136.21,63.5 137.79,65.09 137.79,83.5 129.22,92.08 110.17,92.08 | C16.1 110.17,85.09 110.17,89.85 110.17,90.17 110.17,92.08
  Bottom 0.406: IC18.14 IC18.13 134.62,58.42 135.89,59.69 138.43,59.69 139.7,58.42 IC18.11 139.7,54.61 142.24,52.07 IC18.5 | IC20.14 IC20.13 IC20.12 93.66,91.76 94.61,92.71 97.79,92.71 98.74,91.76 IC20.10 | IC20.10 IC20.9 | IC20.10 IC20.5 IC20.4 | IC4.16 IC4.15 119.06,75.88 120.02,76.83 122.87,76.83 124.14,75.56 IC4.13 IC4.12 IC4.11 IC4.10 | IC11.4 76.83,60.01 78.11,61.28 83.19,61.28 84.45,60.01 IC11.1 | IC12.10 48.26,48.9 | IC6.1 IC6.14 | IC6.5 IC6.4 100.01,31.11 101.6,29.53 101.6,25.08 100.01,23.5 IC6.1 | IC6.1 IC6.2
  Bottom 0.813: C13.1 48.9,75.25 IC9.16 | C18.1 IC15.14 | C2.1 25.4,91.76 IC17.14 | C16.1 IC4.16 | C3.1 IC20.14 | C9.1 IC11.14 | C10.1 IC7.14 | C14.1 IC2.16 | IC18.14 131.13,58.42 C17.1 | C4.1 83.82,76.2 85.41,74.61 IC3.16 | C6.1 IC10.16 | IC5.20 42.86,40.64 C19.1 v41.27,45.72 45.09,45.72 48.26,48.9 60.64,48.9 | 60.64,48.9 63.18,48.9 | 63.18,48.9 65.72,48.9 66.67,47.94 v88.9,47.94 | C7.1 60.64,48.9 | C8.1 63.18,48.9 | IC8.16 C12.1
/ALUSHR  (via drill 0.61 pad 1.27)
  Top 0.406: v91.76,20.95 93.34,20.95 97.16,24.77 109.54,24.77 112.39,27.62 112.39,40.96 117.79,46.35 117.79,53.02 121.6,56.83 IC1.9 | JP9.1 78.74,8.26 88.27,17.78 v91.76,17.78
  Bottom 0.406: v91.76,17.78 v91.76,20.95
/CARRY1
  Top 0.406: JP9.29 41.91,6.99 41.91,4.76 43.5,3.17 90.17,3.17 91.12,4.13 93.03,4.13 94.93,2.22 151.76,2.22 153.67,4.13 153.67,11.75 156.21,14.29 156.21,60.96 153.67,63.5 142.56,63.5 138.43,59.37 138.43,53.34 137.16,52.07 IC18.3
/CARRY3  (via drill 0.61 pad 1.27)
  Top 0.406: JP9.31 39.37,6.99 39.37,4.13 41.27,2.22 91.44,2.22 v92.08,2.86 | v142.56,65.41 135.89,58.74 135.89,54.61 132.08,50.8 IC18.1
  Bottom 0.406: v92.08,2.86 92.39,3.17 132.72,3.17 141.29,11.75 152.4,11.75 158.75,18.1 158.75,60.64 153.99,65.41 v142.56,65.41
/ENIPTR  (via drill 0.61 pad 1.27)
  Top 0.406: IC13.1 51.75,43.5 27.94,43.5 v27.3,42.86 | IC14.1 22.23,18.41 19.68,20.95 IC14.19
  Bottom 0.406: 30.48,6.35 JP9.38 30.48,4.76 29.84,4.13 27.3,4.13 26.67,4.76 26.67,17.46 25.72,18.41 | IC13.19 60.33,36.2 57.78,38.73 IC13.1 | v27.3,42.86 27.3,20 25.72,18.41 | 25.72,18.41 IC14.1
/ENMSW
  Top 0.406: IC5.19 39.37,36.2 36.83,38.73 IC5.1
  Bottom 0.406: JP9.40 29.21,6.99 29.21,24.77 31.75,27.3 36.51,27.3 37.15,27.94 37.15,38.1 36.51,38.73 IC5.1
/FI  (via drill 0.61 pad 1.27)
  Top 0.406: v40.64,53.02 43.5,55.88 46.67,55.88 48.26,57.47 IC12.5
  Bottom 0.406: IC5.6 37.15,26.04 38.1,26.99 38.1,46.04 40.64,48.58 v40.64,53.02 | IC12.5 48.26,57.47 49.85,55.88 106.68,55.88 110.17,52.39 110.17,49.53 110.81,48.9 122.87,48.9 124.46,47.31 149.86,47.31 151.13,48.58 155.26,48.58 156.84,46.99 156.84,22.54 147,12.7 140.97,12.7 132.4,4.13 93.34,4.13 92.71,4.76 92.71,6.35 92.08,6.99 90.17,6.99 JP10.32
/FP  (via drill 0.61 pad 1.27)
  Top 0.406: v69.22,46.35 71.75,48.9 IC11.9
  Bottom 0.406: v69.22,46.35 68.9,46.04 53.34,46.04 44.77,37.47 41.27,37.47 40.01,36.2 40.01,23.81 37.15,20.95 IC5.8 33.66,20.95 33.02,20.32 33.02,17.78 33.66,17.14 37.47,17.14 40.01,19.68 45.4,19.68 46.99,18.1 46.99,13.65 44.45,11.11 44.45,7.62 45.09,6.99 85.09,6.99 JP10.34
/FS  (via drill 0.61 pad 1.27)
  Top 0.406: v14.61,3.17 v14.61,8.57 | v24.45,13.65 26.99,13.65 v30.48,17.14
  Bottom 0.406: IC12.9 45.72,49.21 44.45,47.94 41.27,47.94 39.05,45.72 39.05,25.4 37.15,23.5 IC5.7 33.02,23.5 30.48,20.95 v30.48,17.14 | v14.61,8.57 16.19,10.16 20.95,10.16 v24.45,13.65 | v14.61,3.17 15.56,2.22 87.95,2.22 JP10.30
/LATCH_I  (via drill 0.61 pad 1.27)
  Top 0.406: JP9.47 20,10.48 v31.75,10.48 | v68.26,25.08 68.26,17.14 65.72,14.61 40.32,14.61 39.37,15.56 37.78,15.56 35.88,13.65 v31.75,13.65
  Bottom 0.406: v31.75,10.48 v31.75,13.65 | v68.26,25.08 84.77,25.08 85.72,26.04 85.72,27.94 84.77,28.89 IC7.5
/LATCH_S  (via drill 0.61 pad 1.27)
  Top 0.406: JP9.45 21.59,6.99 33.66,6.99 34.29,7.62 v34.29,10.48 | v38.1,13.65 66.04,13.65 69.53,17.14 v69.53,26.35
  Bottom 0.406: v34.29,10.48 34.92,10.48 v38.1,13.65 | v69.53,26.35 72.07,28.89 IC7.10
/LDMSW  (via drill 0.61 pad 1.27)
  Top 0.406: IC9.1 53.02,66.99 55.56,64.45 58.42,64.45 63.82,59.05 65.72,59.05 68.58,56.2 72.07,56.2 73.03,57.15 73.03,60.01 73.98,60.96 77.79,60.96 79.38,59.37 IC11.3 79.38,57.47 76.83,54.93 IC11.11 76.83,48.9 78.42,47.31 78.42,32.7 77.15,31.43 IC7.9 | IC7.13 77.15,21.27 82.23,26.35 IC7.4 | v45.4,17.14 46.67,18.41 v53.34,18.41
  Bottom 0.406: IC7.4 82.23,26.35 77.15,31.43 IC7.9 | JP9.20 51.75,4.13 40.01,4.13 39.37,4.76 39.37,15.56 40.96,17.14 v45.4,17.14 | v53.34,18.41 53.34,14.92 53.98,14.29 71.75,14.29 73.34,15.88 73.34,19.68 74.93,21.27 IC7.13
/RST  (via drill 0.61 pad 1.27)
  Top 0.406: IC12.4 50.8,60.33 51.44,60.96 56.52,60.96 57.15,60.33 57.15,54.61 55.88,53.34 IC12.13 55.88,49.53 56.83,48.58 63.82,48.58 64.45,47.94 64.45,43.81 v69.53,38.73 69.53,28.26 70.8,26.99 v70.8,22.54 | JP10.7 119.38,9.21 114.62,13.97 97.47,13.97 v95.57,15.88 | IC11.10 74.3,49.21 75.25,48.26 v75.25,40.96
  Bottom 0.406: v70.8,22.54 84.77,22.54 91.44,15.88 v95.57,15.88 | v75.25,40.96 73.03,38.73 v69.53,38.73
ALU_C  (via drill 0.61 pad 1.27)
  Top 0.406: v63.5,63.5 61.91,65.09 61.91,68.9 60.96,69.85 59.05,69.85 58.1,68.9 IC9.3
  Bottom 0.406: v63.5,63.5 73.34,63.5 75.56,61.28 75.56,57.47 76.2,56.83 107.31,56.83 110.81,53.34 112.71,53.34 113.98,52.07 IC1.5
ALU_N
  Top 0.406: IC9.10 68.26,76.83 71.12,79.69 76.52,79.69 80.01,76.2 80.01,73.34 82.55,70.8 99.06,70.8 101.28,68.58 IC3.7
ALU_V
  Top 0.406: IC4.7 131.76,69.85 129.86,71.75 83.19,71.75 81.28,73.66 81.28,76.83 77.47,80.64 63.5,80.64 60.64,77.79 IC9.13
ALU_Z
  Bottom 0.406: IC9.6 65.72,69.53 67.31,71.12 74.61,71.12 75.88,72.39 91.44,72.39 92.39,71.44 101.92,71.44 103.82,73.34 IC3.9
ALUBUS0
  Top 0.406: JP3.1 4.76,85.09 6.67,87 IC17.2
  Bottom 0.406: IC9.2 55.56,68.9 57.47,70.8 63.82,70.8 66.04,73.03 73.34,73.03 75.88,75.56 75.88,92.71 71.44,97.16 20.32,97.16 15.56,92.39 15.56,88.27 16.83,87 IC17.2
ALUBUS1
  Top 0.406: IC17.3 JP3.2
  Bottom 0.406: IC9.5 63.18,68.9 66.36,72.07 73.98,72.07 76.83,74.93 76.83,93.03 71.75,98.11 18.41,98.11 13.97,93.66 13.97,87 16.51,84.45 IC17.3
ALUBUS2  (via drill 0.61 pad 1.27)
  Top 0.406: IC9.11 65.72,74.3 63.5,72.07 46.04,72.07 45.09,73.03 v42.86,73.03
  Bottom 0.406: JP3.3 6.03,83.19 9.84,83.19 13.65,79.38 IC17.5 19.05,78.11 27.3,78.11 29.84,75.56 34.29,75.56 36.83,73.03 v42.86,73.03
ALUBUS3
  Top 0.406: IC9.14 58.1,74.3 56.83,73.03 46.67,73.03 44.13,75.56 29.84,75.56 27.3,78.11 23.5,78.11 22.23,76.83 IC17.6
  Bottom 0.406: IC17.6 13.97,76.83 8.89,81.92 JP3.4
ALUBUS4
  Top 0.406: JP3.5 3.49,78.11 3.49,73.66 4.13,73.03 12.06,73.03 14.61,75.56 22.23,75.56 23.5,74.3 IC17.8 26.67,73.03 26.67,56.52 29.21,53.98 36.2,53.98 41.91,48.26 53.34,48.26 54.61,49.53 54.61,54.29 55.88,55.56 IC12.2
ALUBUS5
  Top 0.406: IC17.9 26.67,76.83 29.21,74.3 29.21,56.83 31.11,54.93 36.51,54.93 42.23,49.21 52.07,49.21 53.34,50.48 IC12.12
  Bottom 0.406: JP3.6 11.11,75.56 23.81,75.56 25.08,76.83 IC17.9
ALUBUS6  (via drill 0.61 pad 1.27)
  Top 0.406: JP3.7 6.03,78.11 11.75,78.11 14.29,80.64 22.23,80.64 23.5,81.92 IC17.11 26.99,81.92 31.43,86.36 35.88,86.36 37.47,87.95 v37.47,94.93 | v72.71,76.52 78.11,71.12 78.11,63.82 80.64,61.28 80.64,55.56 79.38,54.29 IC11.12
  Bottom 0.406: v37.47,94.93 37.78,95.25 70.8,95.25 72.71,93.34 v72.71,76.52
ALUBUS7  (via drill 0.61 pad 1.27)
  Top 0.406: IC17.12 26.67,84.45 27.94,85.72 v27.94,90.17 | v73.98,78.42 79.06,73.34 79.06,64.14 81.92,61.28 IC11.2 81.92,66.67 85.09,69.85 91.76,69.85 93.66,67.94 | 93.66,67.94 94.93,69.22 99.06,69.22 100.01,68.26 100.01,65.09 100.97,64.14 109.86,64.14 115.25,69.53 121.92,69.53 122.87,68.58 122.87,62.23 124.46,60.64 124.46,34.92 123.19,33.66 IC2.11 | IC3.4 93.66,67.94
  Bottom 0.406: v27.94,90.17 30.8,93.03 30.8,95.57 31.43,96.2 71.12,96.2 73.98,93.34 v73.98,78.42 | JP3.8 6.03,78.11 3.49,78.11 2.86,78.74 2.86,81.6 2.54,81.92 2.54,85.09 4.45,87 8.26,87 14.61,80.64 20.32,80.64 24.13,84.45 IC17.12
ALUBUS8
  Bottom 0.406: JP3.9 3.81,74.3 1.59,76.52 1.59,85.72 3.81,87.95 9.53,87.95 14.29,83.19 20.64,83.19 23.18,85.72 27.62,85.72 31.43,81.92 IC16.2
ALUBUS9
  Top 0.406: JP3.10 8.57,75.56 11.75,75.56 14.29,78.11 21.27,78.11 23.81,80.64 29.53,80.64 30.8,79.38 IC16.3
ALUBUS10
  Bottom 0.406: JP3.11 6.03,73.03 29.53,73.03 30.8,74.3 IC16.5
ALUBUS11
  Bottom 0.406: JP3.12 IC16.6
ALUBUS12
  Bottom 0.406: JP3.13 6.03,70.48 37.15,70.48 38.42,69.22 IC16.8
ALUBUS13
  Bottom 0.406: JP3.14 9.21,69.22 10.79,67.63 40.96,67.63 42.23,68.9 42.23,70.48 40.96,71.75 IC16.9
ALUBUS14
  Bottom 0.406: JP3.15 6.03,67.94 8.26,67.94 9.53,66.67 42.23,66.67 44.13,68.58 44.13,73.98 41.27,76.83 IC16.11
ALUBUS15
  Top 0.406: IC3.6 98.74,64.77 100.33,63.18 111.12,63.18 112.71,61.59 112.71,44.45 110.17,41.91 110.17,34.92 108.9,33.66 IC8.11
  Bottom 0.406: JP3.16 8.26,65.72 42.55,65.72 45.09,68.26 | IC16.12 41.27,79.38 45.09,75.56 45.09,68.26 | IC3.6 IC3.5 96.2,65.72 95.57,65.09 90.49,65.09 89.85,65.72 89.85,68.26 88.9,69.22 84.77,69.22 81.28,65.72 47.62,65.72 45.09,68.26
ALUOP1  (via drill 0.61 pad 1.27)
  Top 0.406: IC2.1 131.44,20.95 137.79,27.3 137.79,33.97 143.51,39.69 143.51,53.34 144.78,54.61 IC18.9 | IC8.1 112.08,20.95 109.54,23.5 IC8.15 | JP9.6 72.39,6.99 78.74,6.99 88.27,16.51 92.39,16.51 v93.66,17.78
  Bottom 0.406: IC2.1 126.36,20.95 123.83,23.5 IC2.15 119.7,23.5 117.16,20.95 IC8.1 | v93.66,17.78 96.84,20.95 103.19,20.95 105.73,23.5 IC8.15
ALURES0
  Top 0.406: IC1.4 111.44,52.07 110.17,53.34 107.63,53.34 106.36,52.07 IC1.2
  Bottom 0.406: JP9.25 47.94,10.48 47.94,19.05 45.09,21.91 45.09,30.48 50.48,35.88 50.48,40.32 54.29,44.13 71.12,44.13 73.66,46.67 103.82,46.67 106.36,49.21 IC1.2
ALURES8  (via drill 0.61 pad 1.27)
  Top 0.406: IC1.3 109.22,50.8 109.22,35.88 108.27,34.92 105.73,34.92 100.65,29.84 89.85,29.84 87.95,27.94 87.95,23.18 84.77,20 82.23,20 79.38,17.14 75.25,17.14 70.48,12.38 v43.18,12.38
  Bottom 0.406: v43.18,12.38 JP9.27
BUSCLKB  (via drill 0.61 pad 1.27)
  Top 0.406: JP10.24 99.06,4.76 100.65,3.17 151.45,3.17 152.72,4.45 152.72,18.1 v151.13,19.68
  Bottom 0.406: v151.13,19.68 126.36,19.68 123.83,22.23 120.02,22.23 117.47,19.68 113.03,19.68 111.12,21.59 111.12,23.18 109.54,24.77 105.09,24.77 102.55,22.23 89.85,22.23 89.22,22.86 89.22,24.13 89.85,24.77 93.03,24.77 93.66,25.4 93.66,27.94 93.03,28.57 IC6.12 89.85,28.57 88.9,29.53 88.9,31.43 89.85,32.38 92.71,32.38 93.66,33.34 93.66,35.24 92.71,36.2 IC6.9
CLK0D
  Bottom 0.406: JP10.17 105.41,9.53 88.27,9.53 87.63,8.89 87.63,4.76 86.04,3.17 76.52,3.17 75.88,3.17 26.35,3.17 25.08,4.45 6.99,4.45 6.03,5.4 6.03,9.21 1.27,13.97 1.27,36.51 4.45,39.69 8.57,39.69 11.43,42.55 11.43,50.16 15.88,54.61 31.11,54.61 33.02,52.7 IC10.7
F7  (via drill 0.61 pad 1.27)
  Top 0.406: v70.8,46.04 73.03,48.26 73.03,55.56 74.3,56.83 IC11.5
  Bottom 0.406: IC5.9 37.15,18.41 40.96,22.23 40.96,34.29 41.59,34.92 48.26,34.92 49.53,36.2 49.53,40.64 53.98,45.09 69.85,45.09 v70.8,46.04
FC  (via drill 0.61 pad 1.27)
  Top 0.406: IC5.2 36.83,36.2 40.64,32.38 v50.16,32.38
  Bottom 0.406: IC5.2 33.34,36.2 31.75,37.78 31.75,52.39 30.48,53.66 24.45,53.66 22.86,52.07 IC10.3 | v50.16,32.38 50.16,24.77 51.75,23.18 51.75,15.24 53.66,13.34 122.56,13.34 125.73,10.16 125.73,6.99 JP10.2
FN  (via drill 0.61 pad 1.27)
  Top 0.406: IC5.4 36.83,31.11 40.64,27.3 v47.62,27.3
  Bottom 0.406: IC5.4 33.34,31.11 29.53,34.92 29.53,45.09 27.94,46.67 IC10.5 | v47.62,27.3 47.62,24.77 49.85,22.54 49.85,14.61 53.02,11.43 118.43,11.43 120.65,9.21 120.65,6.99 JP10.6
FV  (via drill 0.61 pad 1.27)
  Top 0.406: v26.04,48.26 29.53,48.26 30.48,49.21 IC10.6 | IC5.5 36.83,28.57 40.64,24.77 v46.35,24.77
  Bottom 0.406: IC5.5 33.34,28.57 28.57,33.34 28.57,44.13 26.04,46.67 v26.04,48.26 | v46.35,24.77 48.9,22.23 48.9,14.29 52.7,10.48 116.84,10.48 118.11,9.21 118.11,6.99 JP10.8
FZ  (via drill 0.61 pad 1.27)
  Top 0.406: IC5.3 36.83,33.66 40.64,29.84 v48.9,29.84
  Bottom 0.406: IC5.3 33.34,33.66 30.48,36.51 30.48,46.04 29.21,47.31 29.21,52.07 28.57,52.7 26.04,52.7 25.4,52.07 IC10.4 | v48.9,29.84 48.9,24.77 50.8,22.86 50.8,14.92 53.34,12.38 120.33,12.38 123.19,9.53 123.19,6.99 JP10.4
GND
  Top 0.406: IC3.3 91.12,67.94 90.17,68.9 87,68.9 86.04,67.94 IC3.1
  Bottom 0.406: C1.2 22.54,14.92 22.54,19.68 23.81,20.95 IC14.2 | IC13.10 58.1,15.88 59.37,17.14 67.63,17.14 69.22,15.56 C10.2
  pour Bottom (isolate 0.61): 0,100.01 160.02,100.01 160.02,0 0,0
  pour Top (isolate 0.61): 0,100.01 160.02,100.01 160.02,0 0,0
LBUS7  (via drill 0.61 pad 1.27)
  Top 0.406: v120.97,47.62 122.24,46.35 IC2.9
  Bottom 0.406: v120.97,47.62 109.54,47.62 107.63,49.53 107.63,52.39 106.68,53.34 96.84,53.34 96.2,53.98 45.4,53.98 43.81,55.56 14.61,55.56 7.94,48.9 JP5.10
LBUS15  (via drill 0.61 pad 1.27)
  Top 0.406: v99.69,54.61 99.69,50.16 107,42.86 IC8.9
  Bottom 0.406: v99.69,54.61 99.38,54.93 46.04,54.93 44.45,56.52 15.24,56.52 12.7,59.05 JP5.2
LOAD_FLAGS0  (via drill 0.61 pad 1.27)
  Top 0.406: IC3.14 91.12,73.34 91.76,72.71 120.97,72.71 121.6,73.34 IC4.14 | IC7.1 85.09,18.73 88.9,22.54 88.9,26.35 89.85,27.3 108.9,27.3 111.44,29.84 111.44,41.27 115.25,45.09 115.25,54.29 116.52,55.56 IC1.11 | v83.5,14.92 78.42,9.84 50.48,9.84 49.53,8.89 49.53,6.99 JP9.24
  Bottom 0.406: IC1.11 122.87,65.09 122.87,72.07 121.6,73.34 IC4.14 | IC7.1 v83.5,14.92
LOAD_FLAGS1  (via drill 0.61 pad 1.27)
  Top 0.406: IC1.10 IC4.2 | IC7.2 84.45,21.27 86.68,23.5 86.68,28.26 87.63,29.21 87.63,62.55 88.58,63.5 IC3.2 | JP9.26 45.72,5.08 46.67,4.13 77.15,4.13 88.27,15.24 v89.53,15.24
  Bottom 0.406: IC3.2 88.58,65.72 90.17,64.14 117.47,64.14 119.06,65.72 IC4.2 | IC7.2 84.45,21.27 89.53,16.19 v89.53,15.24
N$1
  Top 0.406: IC8.5 118.11,31.11 119.38,32.38 123.83,32.38 125.41,33.97 125.41,49.21 126.68,50.48 IC4.5
  Bottom 0.406: IC4.5 IC4.6
N$2
  Bottom 0.406: IC18.4 139.7,51.44 135.89,55.24 113.03,55.24 111.44,56.83 IC1.13
N$3
  Bottom 0.406: IC18.2 134.62,51.44 131.76,54.29 111.12,54.29 108.9,56.52 IC1.14 IC1.15
N$6
  Bottom 0.406: IC16.1 34.92,87 46.35,87 50.48,82.87 IC15.1
N$7
  Bottom 0.406: IC15.2 58.1,80.96 56.52,79.38 51.12,79.38 47.31,83.19 38.42,83.19 36.2,80.96 36.2,78.11 34.92,76.83 IC16.4 33.66,76.83
N$8
  Bottom 0.406: IC15.4 63.18,84.77 63.82,85.41 66.36,85.41 66.99,84.77 66.99,80.96 63.5,77.47 45.09,77.47 41.91,80.64 38.73,80.64 37.15,79.06 37.15,75.88 38.73,74.3 IC16.10
N$9
  Bottom 0.406: IC15.5 65.72,82.55 61.59,78.42 50.48,78.42 46.99,81.92 IC16.13
N$10  (via drill 0.61 pad 1.27)
  Top 0.406: IC17.1 20,91.76 30.48,91.76 v32.38,93.66
  Bottom 0.406: v32.38,93.66 66.67,93.66 68.26,92.08 IC15.9
N$11  (via drill 0.61 pad 1.27)
  Top 0.406: v31.75,87.95 26.99,83.19 20,83.19 18.73,81.92 IC17.4
  Bottom 0.406: IC15.10 65.72,91.12 64.14,92.71 60.01,92.71 59.37,92.08 59.37,89.22 53.98,83.82 50.8,83.82 46.67,87.95 v31.75,87.95
N$12
  Bottom 0.406: IC15.12 60.64,89.22 56.83,85.41 56.83,81.28 55.88,80.33 51.44,80.33 45.72,86.04 36.51,86.04 34.92,84.45 34.92,81.6 33.97,80.64 29.53,80.64 28.26,79.38 IC17.10
N$13
  Bottom 0.406: IC17.13 28.26,87 33.97,92.71 56.52,92.71 58.1,91.12 IC15.13
N$14  (via drill 0.61 pad 1.27)
  Top 0.406: IC15.6 68.26,84.14 69.85,85.72 v79.69,85.72
  Bottom 0.406: v79.69,85.72 82.55,82.87 IC20.1 88.58,81.28 92.39,77.47 92.39,73.34 93.34,72.39 97.79,72.39 98.74,73.34 IC3.11
N$15  (via drill 0.61 pad 1.27)
  Top 0.406: IC15.8 v79.69,90.49
  Bottom 0.406: v79.69,90.49 82.87,87.31 88.9,87.31 91.12,85.09 IC20.2 91.12,80.96 96.2,75.88 IC3.12
N$16
  Bottom 0.406: IC3.10 101.28,75.88 99.06,78.11 95.25,78.11 93.66,79.69 IC20.3
N$17
  Top 0.406: IC10.9 40.64,63.5 58.1,63.5 64.14,57.47 64.14,55.56 66.99,52.7 66.99,45.09 73.34,38.73 73.34,28.26 75.25,26.35 IC7.11
  Bottom 0.406: IC10.10 IC10.9
N$19
  Top 0.406: IC4.4 124.14,67.94 125.41,69.22 127,69.22 127.95,68.26 127.95,50.48 126.36,48.9 126.36,32.7 127.95,31.11 IC2.5
N$21
  Top 0.406: IC18.8 147.32,59.05 146.37,60.01 141.92,60.01 140.97,59.05 140.97,47.31 134.94,41.27 134.94,29.53 131.44,26.04 IC2.3
  Bottom 0.406: IC2.3 126.36,26.04 123.83,28.57 IC2.13 121.92,28.89 120.02,28.89 117.16,26.04 IC8.3 112.08,26.04 109.54,28.57 IC8.13
N$32  (via drill 0.61 pad 1.27)
  Top 0.406: v61.59,63.5 60.64,64.45 IC9.4
  Bottom 0.406: IC10.14 22.86,59.69 26.67,63.5 v61.59,63.5
N$48  (via drill 0.61 pad 1.27)
  Top 0.406: v65.41,62.23 68.26,65.09 IC9.7
  Bottom 0.406: v65.41,62.23 27.94,62.23 25.4,59.69 IC10.13
N$49  (via drill 0.61 pad 1.27)
  Top 0.406: v67.31,62.23 69.53,64.45 69.53,72.07 70.8,73.34 IC9.9
  Bottom 0.406: v67.31,62.23 66.04,60.96 29.21,60.96 27.94,59.69 IC10.12
N$50
  Top 0.406: IC10.11 30.48,59.05 38.1,66.67 48.26,66.67 52.7,71.12 65.09,71.12 66.99,73.03 66.99,76.83 66.04,77.79 64.14,77.79 63.18,76.83 IC9.12
N$51
  Bottom 0.406: IC7.3 IC7.12
N$52  (via drill 0.61 pad 1.27)
  Top 0.406: v65.41,57.15 67.94,54.61 67.94,45.72 74.93,38.73 v77.15,38.73
  Bottom 0.406: IC12.3 53.34,57.47 53.98,56.83 65.09,56.83 v65.41,57.15 | v77.15,38.73 IC6.8
N$53  (via drill 0.61 pad 1.27)
  Top 0.406: v96.84,49.21 96.84,33.02 94.93,31.11 IC6.11
  Bottom 0.406: IC12.11 50.8,52.07 51.75,53.02 69.85,53.02 70.48,52.39 70.48,49.85 71.12,49.21 v96.84,49.21
N$54
  Bottom 0.406: IC7.6 86.68,31.43 88.9,33.66 IC6.10
N$55
  Bottom 0.406: IC7.8 77.79,33.97 81.6,30.16 85.72,30.16 89.85,26.04 IC6.13
OP0
  Bottom 0.406: JP7.9 151.45,39.69 148.27,42.86 74.93,42.86 72.39,40.32 55.56,40.32 54.29,39.05 54.29,34.29 54.93,33.66 IC13.3
OP1
  Bottom 0.406: JP7.8 151.76,42.23 150.18,43.81 74.61,43.81 72.07,41.27 55.24,41.27 53.34,39.37 53.34,32.7 54.93,31.11 IC13.4
OP2
  Bottom 0.406: JP7.7 74.3,44.77 71.75,42.23 54.93,42.23 52.39,39.69 52.39,31.11 54.93,28.57 IC13.5
OP3
  Bottom 0.406: JP7.6 152.08,47.31 150.5,45.72 73.98,45.72 71.44,43.18 54.61,43.18 51.44,40.01 51.44,29.53 54.93,26.04 IC13.6
RBUS0
  Top 0.406: IC13.18 60.33,33.66 59.05,34.92 52.39,34.92 51.12,33.66 IC5.18 40.64,33.66 36.83,37.47 30.8,37.47 28.26,40.01 11.11,40.01 JP4.1
RBUS1
  Top 0.406: IC13.17 60.33,31.11 59.05,32.38 52.39,32.38 51.12,31.11 IC5.17 40.64,31.11 36.83,34.92 30.8,34.92 28.26,37.47 11.11,37.47 JP4.2
RBUS2
  Top 0.406: IC13.16 60.33,28.57 59.05,29.84 52.39,29.84 51.12,28.57 IC5.16 40.64,28.57 36.83,32.38 30.8,32.38 28.26,34.92 13.34,34.92 10.79,32.38 6.03,32.38 JP4.3
RBUS3
  Top 0.406: IC13.15 60.33,26.04 59.05,27.3 52.39,27.3 51.12,26.04 IC5.15 40.64,26.04 36.83,29.84 30.8,29.84 28.26,32.38 12.38,32.38 11.11,31.11 JP4.4
RBUS4
  Top 0.406: IC13.14 60.33,23.5 59.05,24.77 52.07,24.77 50.8,23.5 IC5.14 40.64,23.5 36.83,27.3 30.8,27.3 28.26,29.84 6.03,29.84 JP4.5
RBUS5
  Top 0.406: IC13.13 60.33,20.95 59.05,22.23 47.62,22.23 46.35,20.95 IC5.13 40.64,20.95 36.83,24.77 30.8,24.77 28.26,27.3 12.38,27.3 11.11,28.57 JP4.6
RBUS6
  Top 0.406: IC13.12 60.33,18.41 59.05,19.68 46.35,19.68 45.09,18.41 IC5.12 40.64,18.41 36.83,22.23 30.8,22.23 28.26,24.77 13.34,24.77 10.79,27.3 6.03,27.3 JP4.7
RBUS7  (via drill 0.61 pad 1.27)
  Top 0.406: JP4.8 10.16,26.04 13.97,22.23 27.94,22.23 30.48,19.68 36.83,19.68 40.64,15.88 IC5.11 47.94,15.88 49.21,17.14 59.05,17.14 60.33,15.88 IC13.11 65.09,15.88 66.67,17.46 66.67,25.72 68.26,27.3 v68.26,35.56 | v79.69,40.01 v79.69,35.56
  Bottom 0.406: IC2.10 119.7,36.2 118.43,37.47 96.2,37.47 93.66,40.01 v79.69,40.01 | v79.69,35.56 v68.26,35.56
RBUS8
  Bottom 0.406: JP4.9 6.03,22.23 13.02,22.23 14.29,23.5 IC14.18
RBUS9
  Bottom 0.406: JP4.10 12.38,23.5 14.92,26.04 IC14.17
RBUS10
  Bottom 0.406: JP4.11 6.03,19.68 18.1,19.68 19.68,21.27 19.68,27.3 18.41,28.57 IC14.16
RBUS11
  Bottom 0.406: JP4.12 13.65,20.95 14.92,22.23 18.1,22.23 18.73,22.86 18.73,26.67 18.1,27.3 15.24,27.3 14.29,28.26 14.29,30.16 15.24,31.11 IC14.15
RBUS12
  Bottom 0.406: JP4.13 6.03,17.14 8.26,17.14 9.53,15.88 18.1,15.88 21.59,19.37 21.59,31.43 19.37,33.66 IC14.14
RBUS13
  Bottom 0.406: IC14.13 15.24,36.2 14.29,35.24 14.29,33.34 15.24,32.38 19.37,32.38 20.64,31.11 20.64,19.68 17.78,16.83 9.84,16.83 8.26,18.41 JP4.14
RBUS14
  Bottom 0.406: JP4.15 3.17,17.46 3.17,34.92 4.45,36.2 13.65,36.2 16.19,38.73 IC14.12
RBUS15  (via drill 0.61 pad 1.27)
  Top 0.406: v67.94,37.47 62.23,37.47 55.24,44.45 26.99,44.45 25.4,42.86 18.41,42.86 IC14.11
  Bottom 0.406: v67.94,37.47 93.66,37.47 96.2,34.92 102.55,34.92 103.82,36.2 IC8.10 | JP4.16 6.03,14.61 3.49,14.61 2.22,15.88 2.22,35.56 3.81,37.15 12.06,37.15 16.19,41.27 IC14.11
RST  (via drill 0.61 pad 1.27)
  Top 0.406: v151.45,13.65 151.45,5.4 150.18,4.13 118.75,4.13 118.11,4.76 118.11,6.99 JP10.9
  Bottom 0.406: IC10.15 20.32,59.69 25.4,64.77 74.61,64.77 76.2,63.18 113.98,63.18 115.25,61.91 115.25,57.15 116.2,56.2 123.19,56.2 130.49,63.5 154.31,63.5 157.8,60.01 157.8,20 v151.45,13.65

### Text on the board
Top: #4
tsilk: VCC2 | GND1 | IC17 | 74LS02N | JP3 | IC16 | 74LS21N | 74LS08N | 74LS02N | IC15 | IC20 | 74LS157N | 74LS153N | 74LS153N | IC9 | IC3 | IC4 | JP7 | JP5 | IC12 | IC11 | 74LS74N | 74LS74N | 74LS173N | 74LS151N | 74LS04N | IC10 | IC1 | IC18 | IC5 | IC13 | 74LS541N | 74LS541N | JP4 | JP2 | 74LS32N | IC6 | 74LS151N | 74LS151N | 74LS541N | 74LS08N | IC8 | IC2 | IC14 | IC7 | GND2 | VCC1 | 10u | JP9 | JP10